# Altium schematic sheet gpio.SchDoc: GPN-Badge
size A4; Address4: Niklas Fauth; Revision: V2.0; SheetNumber: 1; SheetTotal: 3
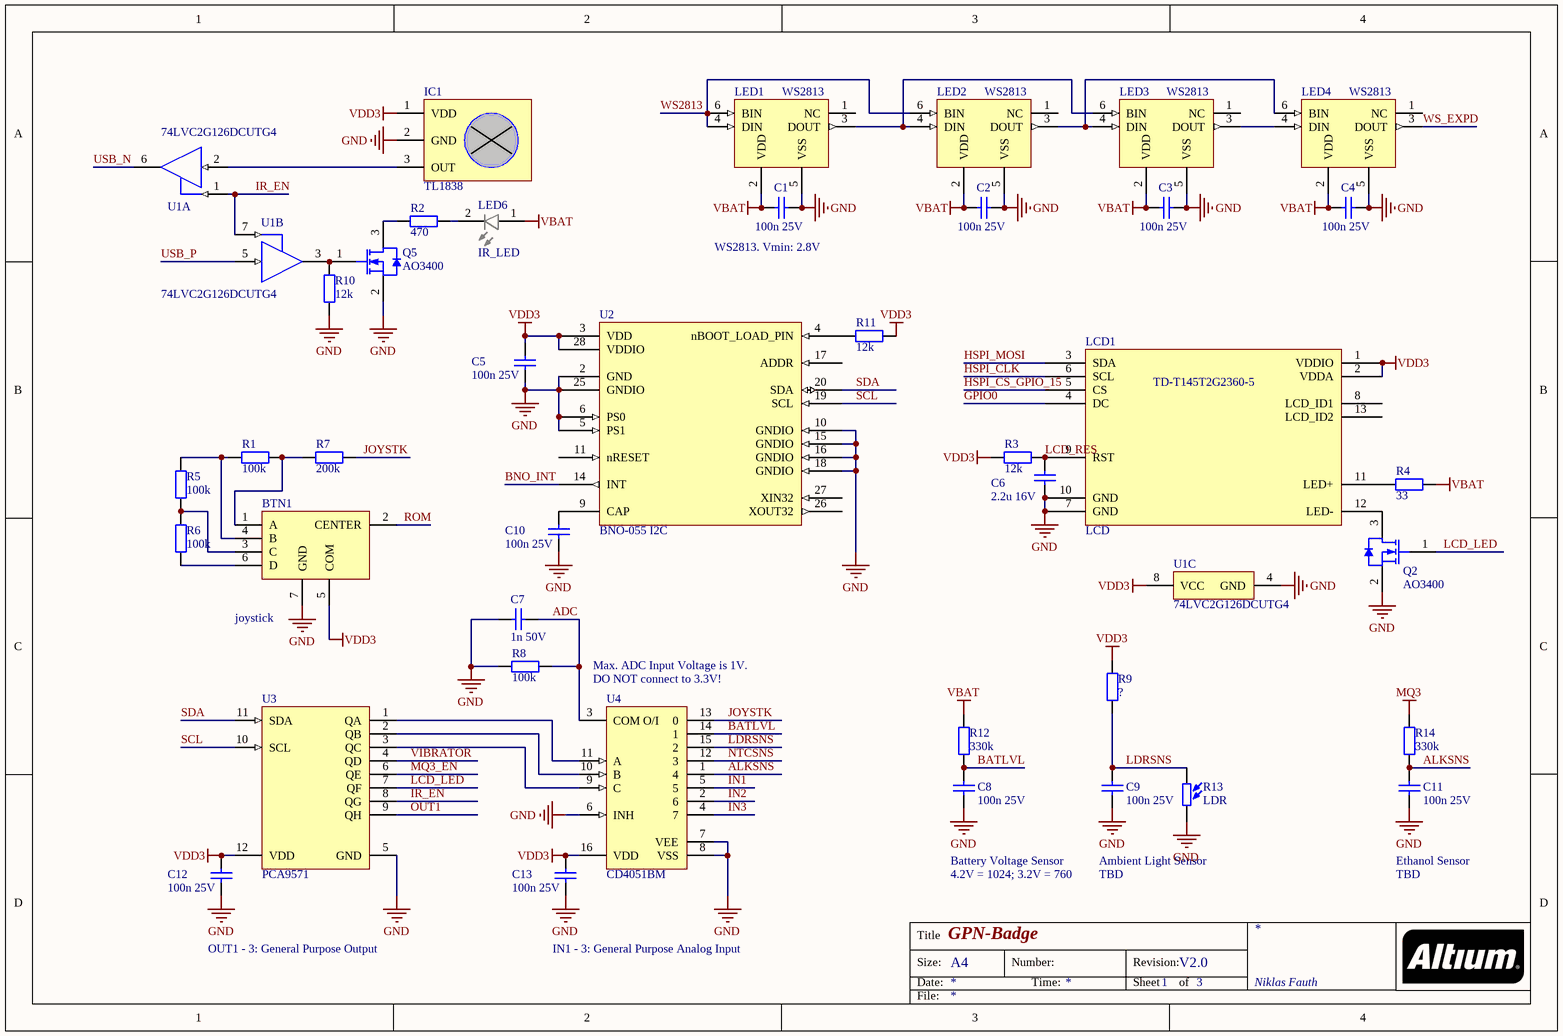
[diagram p0: gpio.SchDoc]

## Parts
BTN1  joystick  [joystick]
C1  100n 25V  [C-0603-M]
C2  100n 25V  [C-0603-M]
C3  100n 25V  [C-0603-M]
C4  100n 25V  [C-0603-M]
C5  100n 25V  [C-0603-M]
C6  2.2u 16V  [C-0603-M]
C7  1n 50V  [C-0603-M]
C8  100n 25V  [C-0603-M]
C9  100n 25V  [C-0603-M]
C10  100n 25V  [C-0603-M]
C11  100n 25V  [C-0603-M]
C12  100n 25V  [C-0603-M]
C13  100n 25V  [C-0603-M]
IC1  TL1838  [TL1838]
LCD1  LCD  [LCD]
LED1  WS2813  [plcc6]
LED2  WS2813  [plcc6]
LED3  WS2813  [plcc6]
LED4  WS2813  [plcc6]
LED6  IR_LED  [IR_LED]
Q2  AO3400  [AO-SOT23-3_V]
Q5  AO3400  [AO-SOT23-3_V]
R1  100k  [R-0603-M]
R2  470  [R-0603-M]
R3  12k  [R-0603-M]
R4  33  [R-0603-M]
R5  100k  [R-0603-M]
R6  100k  [R-0603-M]
R7  200k  [R-0603-H]
R8  100k  [R-0603-M]
R9  ?  [R-0603-M]
R10  12k  [R-0603-M]
R11  12k  [R-0603-M]
R12  330k  [R-0603-M]
R13  LDR  [LDR-5mm]
R14  330k  [R-0603-M]
U1  74LVC2G126DCUTG4  [DCU0008A_L]  (parts A,B,C of 3)
U2  BNO-055 I2C  [BNO-055]
U3  PCA9571  [SON40P210X100-10N]
U4  CD4051BM  [D0016A_M]

## Nets
GND: BTN1.7(GND) C1.1 C2.1 C3.1 C4.1 C5.1 C6.1 C7.1 C8.1 C9.1 C10.1 C11.1 C12.1 C13.1 IC1.2(GND) LCD1.7(GND) LCD1.10(GND) LED1.5(VSS) LED2.5(VSS) LED3.5(VSS) LED4.5(VSS) Q2.2(S) Q5.2(S) R8.1 R10.1 R13.2 U1.4(GND) U2.2(GND) U2.5(PS1) U2.6(PS0) U2.10(GNDIO) U2.15(GNDIO) U2.16(GNDIO) U2.18(GNDIO) U2.25(GNDIO) U3.5(GND) U4.6(INH) U4.7(VEE) U4.8(VSS)
MQ3: R14.2
VBAT: C1.2 C2.2 C3.2 C4.2 LED1.2(VDD) LED2.2(VDD) LED3.2(VDD) LED4.2(VDD) LED6.1(A) R4.2 R12.2
VDD3: BTN1.5(COM) C5.2 C12.2 C13.2 IC1.1(VDD) LCD1.1(VDDIO) LCD1.2(VDDA) R3.1 R9.2 R11.2 U1.8(VCC) U2.3(VDD) U2.28(VDDIO) U3.12(VDD) U4.16(VDD)
ADC: C7.2 R8.2 U4.3(COM_O/I)
ALKSNS: C11.2 R14.1 U4.1(4)
BATLVL: C8.2 R12.1 U4.14(1)
BNO_INT: U2.14(INT)
GPIO0: LCD1.4(DC)
HSPI_CLK: LCD1.6(SCL)
HSPI_CS_GPIO_15: LCD1.5(CS)
HSPI_MOSI: LCD1.3(SDA)
IN1: U4.5
IN2: U4.2(6)
IN3: U4.4(7)
IR_EN: U1.1(1OE) U1.7(2OE) U3.8(QG)
JOYSTK: R7.1 U4.13(0)
LCD_LED: Q2.1(G) U3.7(QF)
LCD_RES: C6.2 LCD1.9(RST) R3.2
LDRSNS: C9.2 R9.1 R13.1 U4.15(2)
MQ3_EN: U3.6(QE)
NTCSNS: U4.12(3)
OUT1: U3.9(QH)
ROM: BTN1.2(CENTER)
SCL: U2.19(SCL) U3.10(SCL)
SDA: U2.20(SDA) U3.11(SDA)
USB_N: U1.6(1Y)
USB_P: U1.5(2A)
VIBRATOR: U3.4(QD)
WS2813: LED1.4(DIN) LED1.6(BIN) LED2.6(BIN)
WS_EXPD: LED4.3(DOUT)
NetBTN1_1: BTN1.1(A) R1.2 R7.2
NetBTN1_3: BTN1.3(C) R5.1 R6.2
NetBTN1_4: BTN1.4(B) R1.1 R5.2
NetBTN1_6: BTN1.6(D) R6.1
NetC10_2: C10.2 U2.9(CAP)
NetIC1_3: IC1.3(OUT) U1.2(1A)
NetLCD1_11: LCD1.11(LED+) R4.1
NetLCD1_12: LCD1.12(LED-) Q2.3(D)
NetLED1_3: LED1.3(DOUT) LED2.4(DIN) LED3.6(BIN)
NetLED2_3: LED2.3(DOUT) LED3.4(DIN) LED4.6(BIN)
NetLED3_3: LED3.3(DOUT) LED4.4(DIN)
NetLED6_2: LED6.2(K) R2.2
NetQ5_1: Q5.1(G) R10.2 U1.3(2Y)
NetQ5_3: Q5.3(D) R2.1
NetR11_1: R11.1 U2.4(nBOOT_LOAD_PIN)
NetU3_1: U3.1(QA) U4.11(A)
NetU3_2: U3.2(QB) U4.10(B)
NetU3_3: U3.3(QC) U4.9(C)

Not connected (* = marked no-connect by the designer): LCD1 8(LCD_ID1) 13(LCD_ID2); LED1 1(NC); LED2 1(NC); LED3 1(NC); LED4 1(NC); U2 11(nRESET) 17(ADDR) 26(XOUT32) 27(XIN32)

## Notes on the sheet
- (near C1) WS2813. Vmin: 2.8V
- Max. ADC Input Voltage is 1V.
- DO NOT connect to 3.3V!
- Battery Voltage Sensor
- 4.2V = 1024; 3.2V = 760
- Ambient Light Sensor
- TBD
- Ethanol Sensor
- OUT1 - 3: General Purpose Output
- IN1 - 3: General Purpose Analog Input
- Title
- Size:
- Date:
- A4
- Number:
- Time:
- Revision:
- Sheet
- of
- File:
- (in symbol LCD) TD-T145T2G2360-5

## Library data of the parts
C1-C5 C8-C13 = C-0603-100n-25V: Capacitor 100n 25V; Supplier 1: Mouser; Supplier Part Number 1: 80-C0603C104K3R
C6 = C-0603-2u2-16V: Capacitor 2.2uF 16V; Supplier 1: Mouser; Supplier Part Number 1: 80-C0603C225K4P
C7 = C-0603-1n-50V: Capacitor 1nF 50V; Supplier 1: Mouser; Supplier Part Number 1: 80-C0603C102J5G
LED1-LED4 = WS2813: WS2813 Addressable LED
Q2 Q5 = CMP-0278-00001-1: N-channel Enhancement Mode Field-Effect Transistor; 5.8A/30V; Manufacturer: Alpha and Omega; Channel Type: N; Drain-Source Voltage Limit: 30 V; Junction Temperature: -55 to 150 degC; Gate-Source Voltage Limit: +/-12 V; PackageDescription: 3-Pin SOT23, 3.016 x 2.8 mm Body, 0.95 mm Pitch; ComponentLink2Description: Datasheet; DatasheetVersion: Rev.8, 12/2011; ComponentLink3URL: http://www.aosmd.com/res/packaging_information/SOT-23.pdf; Storage Temperature: -55 to 150 degC; ComponentLink3Description: Package Specification; PackageReference: SOT23; ComponentLink1Description: Manufacturer URL; Mounting Technology: Surface Mount; ComponentLink1URL: http://www.aosmd.com/; PartNumber: AO3400; ComponentLink2URL: http://www.aosmd.com/res/data_sheets/AO3400.pdf
R1 R5 R6 R8 = R-0603-100k: Resistor 100k; Supplier 1: Mouser; Supplier Part Number 1: 71-CRCW0603-100K-E3
R2 = R-0603-470: Resistor 470; Supplier 1: Mouser; Supplier Part Number 1: 71-CRCW0603-470K-E3
R3 R10 R11 = R-0603-12k: Resistor 12k; Supplier 1: Mouser; Supplier Part Number 1: 71-CRCW0603-12K-E3
R4 = R-0603-10: Resistor 10; Supplier 1: Mouser; Supplier Part Number 1: 71-CRCW0603-10-E3
R7 = R-0603-200k: Resistor 200k; Supplier 1: Mouser; Supplier Part Number 1: 71-CRCW0603-200K-E3
R9 R12 R14 = R-0603-300k: Resistor 300k; Resistance: 300k; Supplier 1: Mouser; Supplier Part Number 1: 71-CRCW0201300KFKED
U1 = CMP-0859-00683-3: Dual Bus Buffer Gate With 3-State Outputs, DCU0008A, SMALL T&R; Manufacturer: Texas Instruments; Generic Part Number: SN74LVC2G126; Voltage(Nom)(V): 1.8,2.5,3.3,5; Logic: True; Input Type: CMOS/TTL; tpd @ Nom Voltage(Max)(ns): 9.8,4.9,4,3.2; Output Drive (IOL/IOH)(Max)(mA): 32/-32; ICC @ Nom Voltage(Max)(mA): 0.01; Output Type: CMOS; Bits(#): 2; Schmitt Trigger: No; 3-State Output: Yes; Sub-Family: Non-Inverting Buffer/Driver; F @ Nom Voltage(Max)(Mhz): 150; VCC(Min)(V): 1.65; Technology Family: LVC; Rating: Catalog; VCC(Max)(V): 5.5; Operating Temperature Range(C): -40 to 125; DatasheetVersion: SCES205L; PackageReference: DCU0008A; PartId: 1
U2 = BNO-055-I2C: Bosch Sensortec 9-Axis motion fusion sensor; Supplier 1: Mouser; Supplier Part Number 1: 262-BNO055
U3 = PCA9571: I2C Port extender
U4 = CMP-1575-00043-4: CMOS Single 8-Channel Analog Multiplexer/Demultiplexer with Logic-Level Conversion, D0016A, TUBE; Manufacturer: Texas Instruments; Ron(Typ)(Ohms): 125; Configuration: 1 X 1：8 MUX; ICC(Typ)(mA): 0.00008; Ron(Max)(Ohms): 240; VCC(Min)(V): 5; VCC(Max)(V): 18; Crosstalk: Yes; Bandwidth(Max)(MHz): 20; Rating: Military; Output Drive (IOL/IOH)(Max)(mA): 1; DatasheetVersion: SCHS047G; Generic Part Number: CD4051B; Output Type: CMOS; PackageReference: D0016A; PackageVersion: http://www.ti.com/lit/ml/mpds178g/mpds178g.pdf; Operating Temperature Range(C): -55 to 125; Code_JEDEC: MS-012 variation AC